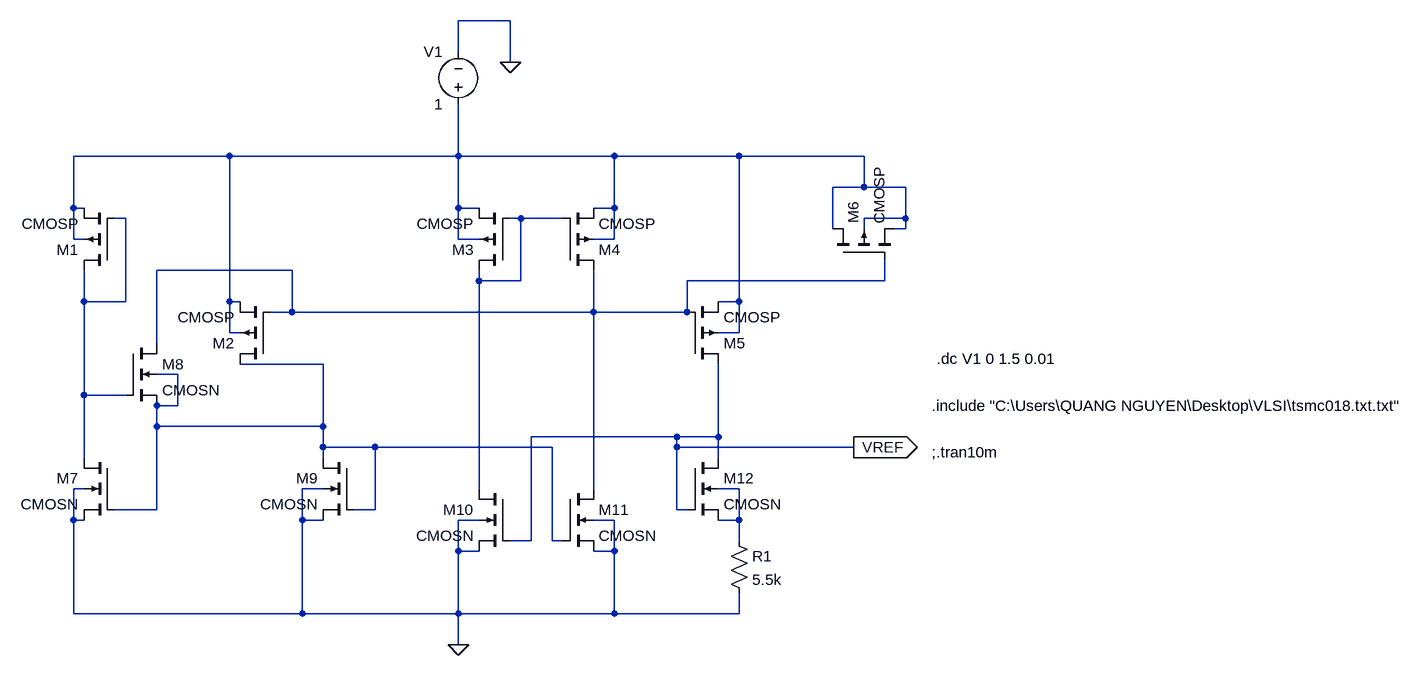
[diagram p0: schematic 23.13.asc]
23.13.asc, the LTspice schematic file:
Version 4
SHEET 1 1928 680
WIRE 480 -352 400 -352
WIRE 400 -304 400 -352
WIRE 480 -288 480 -352
WIRE 48 -144 -192 -144
WIRE 400 -144 400 -224
WIRE 400 -144 48 -144
WIRE 640 -144 400 -144
WIRE 832 -144 640 -144
WIRE 1024 -144 832 -144
WIRE 1024 -96 1024 -144
WIRE 1024 -96 976 -96
WIRE 1088 -96 1024 -96
WIRE -192 -64 -192 -144
WIRE -176 -64 -192 -64
WIRE 400 -64 400 -144
WIRE 432 -64 400 -64
WIRE 640 -64 640 -144
WIRE 640 -64 608 -64
WIRE -112 -48 -128 -48
WIRE 496 -48 480 -48
WIRE 560 -48 496 -48
WIRE 1088 -48 1088 -96
WIRE 1088 -48 1024 -48
WIRE 976 -32 976 -96
WIRE 1024 -32 1024 -48
WIRE 1088 -32 1088 -48
WIRE 1088 -32 1072 -32
WIRE -192 -16 -192 -64
WIRE -176 -16 -192 -16
WIRE 400 -16 400 -64
WIRE 432 -16 400 -16
WIRE 640 -16 640 -64
WIRE 640 -16 608 -16
WIRE 144 32 -64 32
WIRE 432 48 432 32
WIRE 496 48 496 -48
WIRE 496 48 432 48
WIRE 1056 48 1056 16
WIRE 1056 48 752 48
WIRE -176 80 -176 32
WIRE -112 80 -112 -48
WIRE -112 80 -176 80
WIRE 48 80 48 -144
WIRE 64 80 48 80
WIRE 832 80 832 -144
WIRE 832 80 800 80
WIRE 144 96 144 32
WIRE 144 96 112 96
WIRE 608 96 608 32
WIRE 608 96 144 96
WIRE 752 96 752 48
WIRE 752 96 608 96
WIRE 48 128 48 80
WIRE 64 128 48 128
WIRE 832 128 832 80
WIRE 832 128 800 128
WIRE -64 144 -64 32
WIRE 192 176 64 176
WIRE -32 192 -64 192
WIRE -176 224 -176 80
WIRE -112 224 -176 224
WIRE -32 240 -32 192
WIRE -32 240 -64 240
WIRE -64 272 -64 240
WIRE 192 272 192 176
WIRE 192 272 -64 272
WIRE 736 288 512 288
WIRE 800 288 800 176
WIRE 800 288 736 288
WIRE 192 304 192 272
WIRE 272 304 192 304
WIRE 544 304 272 304
WIRE 736 304 736 288
WIRE 1008 304 736 304
WIRE -176 320 -176 224
WIRE 192 320 192 304
WIRE 800 320 800 288
WIRE -176 368 -192 368
WIRE 192 368 160 368
WIRE 432 368 432 48
WIRE 608 368 608 96
WIRE 832 368 800 368
WIRE -64 400 -64 272
WIRE -64 400 -128 400
WIRE 272 400 272 304
WIRE 272 400 240 400
WIRE 736 400 736 304
WIRE 752 400 736 400
WIRE -192 416 -192 368
WIRE -176 416 -192 416
WIRE 160 416 160 368
WIRE 192 416 160 416
WIRE 432 416 400 416
WIRE 640 416 608 416
WIRE 832 416 832 368
WIRE 832 416 800 416
WIRE 512 448 512 288
WIRE 512 448 480 448
WIRE 544 448 544 304
WIRE 560 448 544 448
WIRE 832 448 832 416
WIRE 400 464 400 416
WIRE 432 464 400 464
WIRE 640 464 640 416
WIRE 640 464 608 464
WIRE -192 560 -192 416
WIRE 160 560 160 416
WIRE 160 560 -192 560
WIRE 400 560 400 464
WIRE 400 560 160 560
WIRE 640 560 640 464
WIRE 640 560 400 560
WIRE 832 560 832 528
WIRE 832 560 640 560
WIRE 400 608 400 560
FLAG 400 608 0
FLAG 1008 304 VREF
IOPIN 1008 304 Out
FLAG 480 -288 0
SYMBOL pmos4 -128 32 R180
SYMATTR InstName M1
SYMATTR Value CMOSP
SYMATTR Value2 l=500n w=1000n
SYMBOL pmos4 112 176 R180
SYMATTR InstName M2
SYMATTR Value2 l=500n w=25u
SYMATTR Value CMOSP
SYMBOL pmos4 480 32 R180
SYMATTR InstName M3
SYMATTR Value2 l=500n w=25u
SYMATTR Value CMOSP
SYMBOL pmos4 560 32 M180
SYMATTR InstName M4
SYMATTR Value2 l=500n w=25u
SYMATTR Value CMOSP
SYMBOL pmos4 752 176 M180
SYMATTR InstName M5
SYMATTR Value2 l=500n w=25u
SYMATTR Value CMOSP
SYMBOL pmos4 976 16 R270
SYMATTR InstName M6
SYMATTR Value2 l=500n w=500n
SYMATTR Value CMOSP
SYMBOL nmos4 -128 320 M0
SYMATTR InstName M7
SYMATTR Value2 l=10u w=2u
SYMATTR Value CMOSN
SYMBOL nmos4 -112 144 R0
SYMATTR InstName M8
SYMATTR Value2 l=10u w=1u
SYMATTR Value CMOSN
SYMBOL nmos4 240 320 M0
SYMATTR InstName M9
SYMATTR Value2 l=500n w=2.5u
SYMATTR Value CMOSN
SYMBOL nmos4 480 368 M0
SYMATTR InstName M10
SYMATTR Value2 l=500n w=2.5u
SYMATTR Value CMOSN
SYMBOL nmos4 560 368 R0
SYMATTR InstName M11
SYMATTR Value2 l=500n w=2.5u
SYMATTR Value CMOSN
SYMBOL nmos4 752 320 R0
SYMATTR InstName M12
SYMATTR Value2 l=500n w=10u
SYMATTR Value CMOSN
SYMBOL res 816 432 R0
SYMATTR InstName R1
SYMATTR Value 5.5k
SYMBOL voltage 400 -208 R180
WINDOW 0 24 96 Left 2
WINDOW 3 24 16 Left 2
SYMATTR InstName V1
SYMATTR Value 1
TEXT 1136 168 Left 2 !.dc V1 0 1.5 0.01
TEXT 1128 240 Left 2 !.include "C:\\Users\\QUANG NGUYEN\\Desktop\\VLSI\\tsmc018.txt.txt"
TEXT 1128 312 Left 2 !;.tran10m

The netlist it stands for:
* 23.13.asc
M1 N002 N002 N001 N001 CMOSP l=500n w=1000n
M2 N005 N004 N001 N001 CMOSP l=500n w=25u
M3 N003 N003 N001 N001 CMOSP l=500n w=25u
M4 N004 N003 N001 N001 CMOSP l=500n w=25u
M5 VREF N004 N001 N001 CMOSP l=500n w=25u
M6 N001 N004 N001 N001 CMOSP l=500n w=500n
M7 N002 N005 0 0 CMOSN l=10u w=2u
M8 N004 N002 N005 N005 CMOSN l=10u w=1u
M9 N005 N005 0 0 CMOSN l=500n w=2.5u
M10 N003 VREF 0 0 CMOSN l=500n w=2.5u
M11 N004 N005 0 0 CMOSN l=500n w=2.5u
M12 VREF VREF N006 N006 CMOSN l=500n w=10u
R1 N006 0 5.5k
V1 N001 0 1
.model NMOS NMOS
.model PMOS PMOS
.lib standard.mos
.dc V1 0 1.5 0.01
.include "C:\Users\QUANG NGUYEN\Desktop\VLSI\tsmc018.txt.txt"
;.tran10m
.backanno
.end